# EAGLE design 5draft_onBoard_rework (EAGLE 8.1.0)
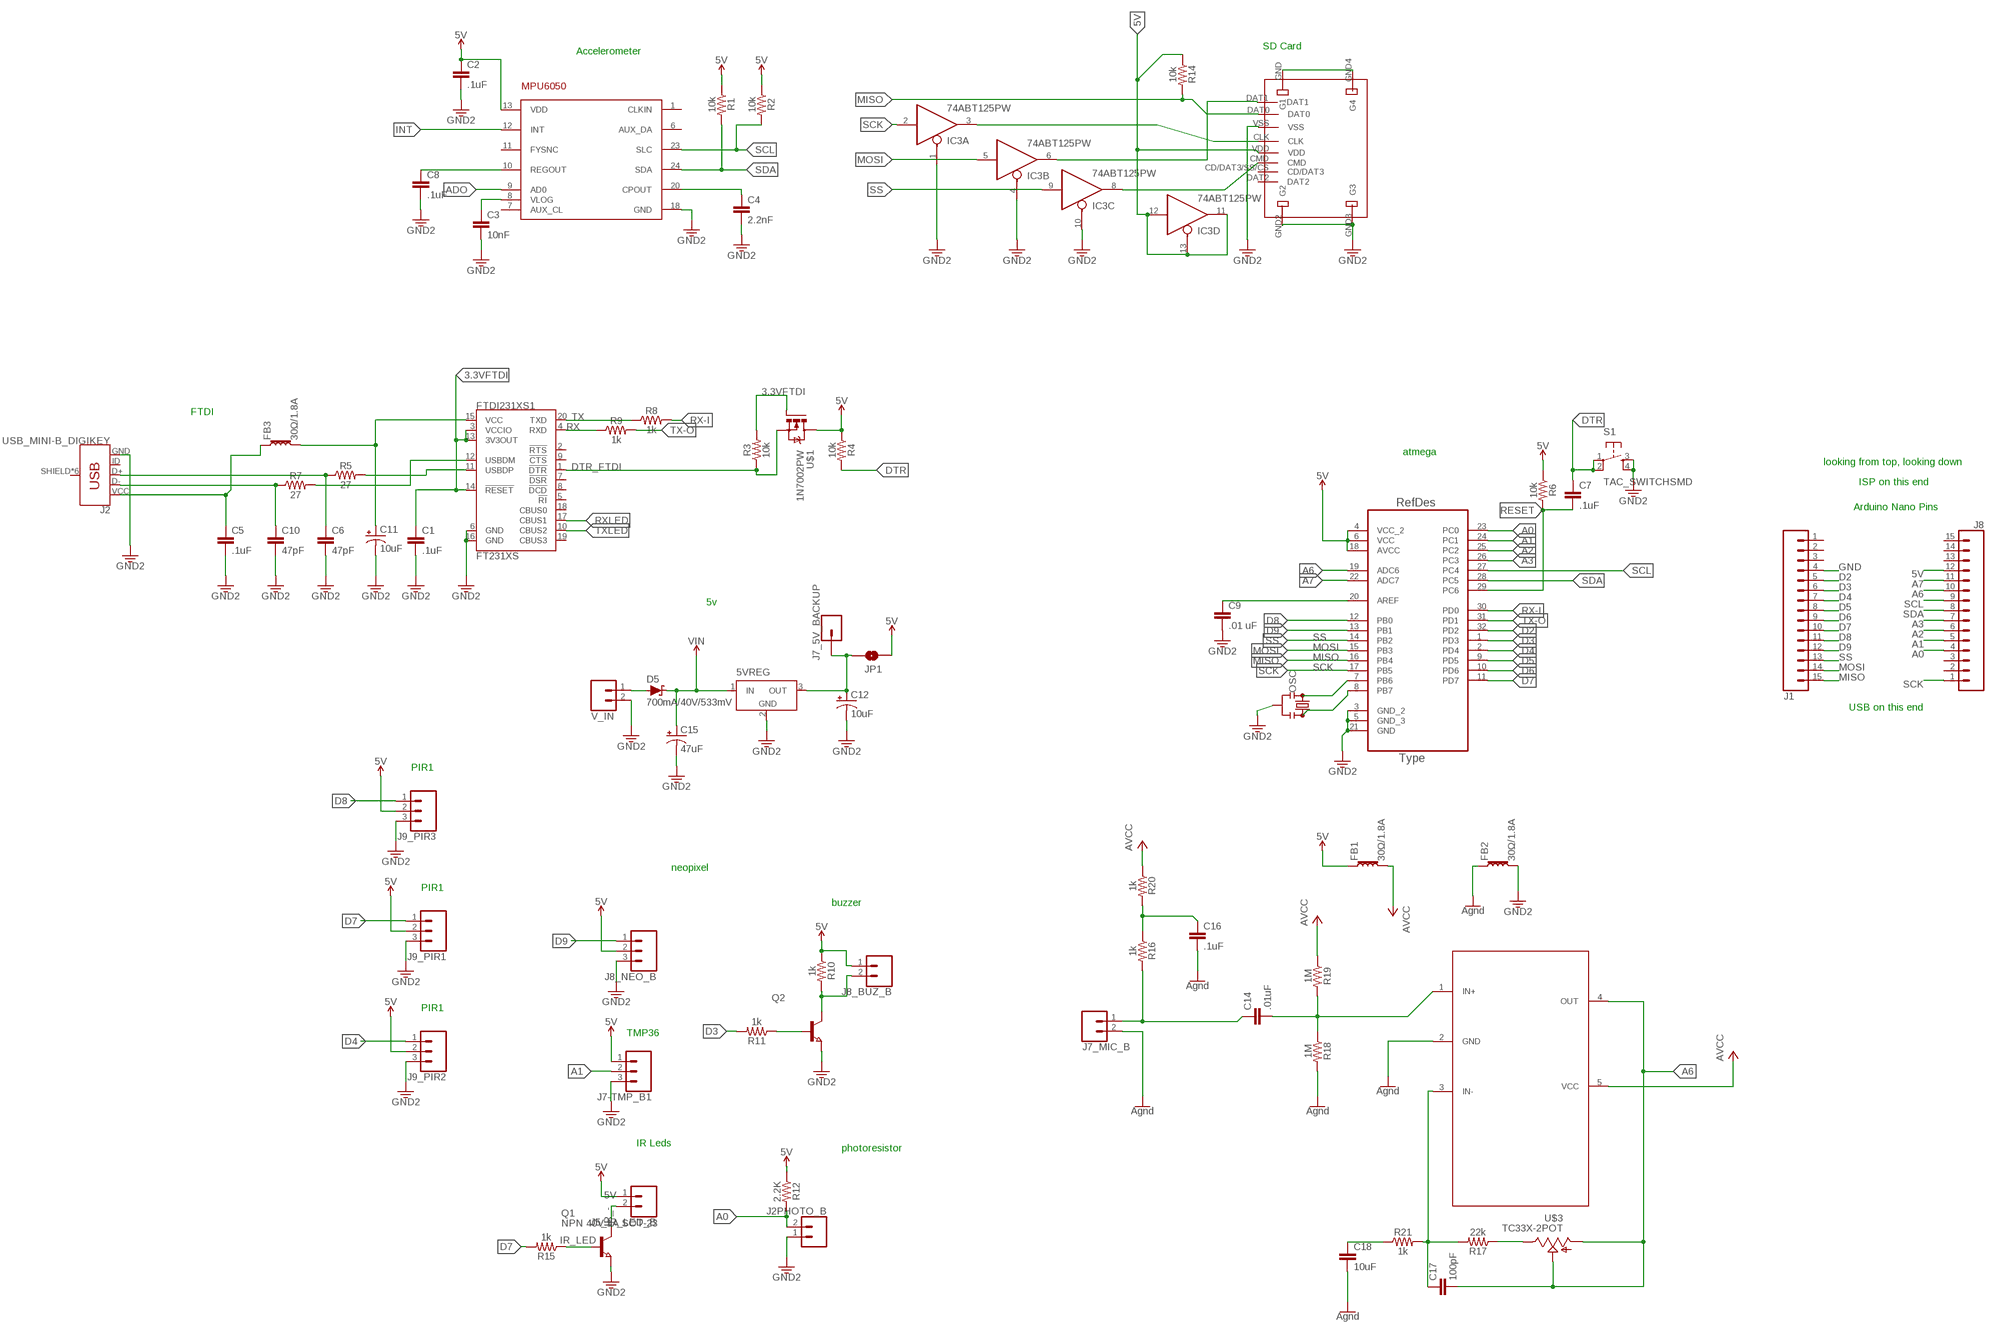
[diagram p0: schematic, sheet 1]

## Parts
5VREG  LT1129CST5  [SOT223]
ATMEGA328P-AU  ATMEGA328P-AU  [QFP80P900X900X120-32N]
C1  .1uF  .22UF-CER  [0402-CAP]
C2  .1uF  .22UF-CER  [0402-CAP]
C3  10nF  .22UF-CER  [0402-CAP]
C4  2.2nF  .22UF-CER  [0402-CAP]
C5  .1uF  .22UF-CER  [0402-CAP]
C6  47pF  .22UF-CER  [0402-CAP]
C7  .1uF  .22UF-CER  [0402-CAP]
C8  .1uF  .22UF-CER  [0402-CAP]
C9  .01 uF  .22UF-CER  [0402-CAP]
C10  47pF  .22UF-CER  [0402-CAP]
C11  10uF  10UF-TANT  [EIA3216]
C12  10uF  10UF-TANT  [EIA3216]
C14  .01uF  .22UF-CER  [0402-CAP]
C15  47uF  10UF-TANT  [EIA3216]
C16  .1uF  .22UF-CER  [0402-CAP]
C17  100pF  .22UF-CER  [0402-CAP]
C18  10uF  .22UF-CER  [0402-CAP]
D5  700mA/40V/533mV  DIODE-SCHOTTKY-ZLLS500  [SOT23-3]
FB1  30Ω/1.8A  FERRITE_BEAD-0603  [0603]
FB2  30Ω/1.8A  FERRITE_BEAD-0603  [0603]
FB3  30Ω/1.8A  FERRITE_BEAD-0603  [0603]
FTDI231XS1  FT231XS  [SSOP20_L]
IC3  74ABT125PW  [TSSOP14]
IC4  MAX4466KS  [SC70-5]
J1  CONN_15  [1X15]
J2  USB_MINI-B_DIGIKEY  [MICRO-USB-DIGIKEY-FCI2]
J2PHOTO_B  CONN_02LOCK  [1X02_LOCK]
J5_IR_LED_B  CONN_02LOCK  [1X02_LOCK]
J7-TMP_B1  CONN_03  [1X03]
J7_5V_BACKUP  CONN_01  [1X01]
J7_MIC_B  CONN_02LOCK  [1X02_LOCK]
J8  CONN_15  [1X15]
J8_BUZ_B  CONN_02LOCK  [1X02_LOCK]
J8_NEO_B  CONN_03  [1X03]
J9_PIR1  CONN_03  [1X03]
J9_PIR2  CONN_03  [1X03]
J9_PIR3  CONN_03  [1X03]
JP1  JUMPER-SMT_2_NO_NO-SILK_ROUND  [SMT-JUMPER_2_NO_NO-SILK_ROUND]
MPU6050  MPU-6050  [QFN24-4X4]
OSC  RESONATORSMD-3.2X1.3  [RESONATOR-SMD-3.2X1.3]
Q1  NPN 40V 1A SOT-23  NPN-TRANSISTOR_SOT23  [SOT23]
Q2  NPN-TRANSISTOR_SOT23  [SOT23]
R1  10k  0.05OHM-0603-1/5W-1%  [0603]
R2  10k  0.05OHM-0603-1/5W-1%  [0603]
R3  10k  0.05OHM-0603-1/5W-1%  [0603]
R4  10k  0.05OHM-0603-1/5W-1%  [0603]
R5  27  0.05OHM-0603-1/5W-1%  [0603]
R6  10k  0.05OHM-0603-1/5W-1%  [0603]
R7  27  0.05OHM-0603-1/5W-1%  [0603]
R8  1k  0.05OHM-0603-1/5W-1%  [0603]
R9  1k  0.05OHM-0603-1/5W-1%  [0603]
R10  1k  0.05OHM-0603-1/5W-1%  [0603]
R11  1k  0.05OHM-0603-1/5W-1%  [0603]
R12  2.2K  0.05OHM-0603-1/5W-1%  [0603]
R14  10k  0.05OHM-0603-1/5W-1%  [0603]
R15  1k  0.05OHM-0603-1/5W-1%  [0603]
R16  1k  0.05OHM-0603-1/5W-1%  [0603]
R17  22k  0.05OHM-0603-1/5W-1%  [0603]
R18  1M  0.05OHM-0603-1/5W-1%  [0603]
R19  1M  0.05OHM-0603-1/5W-1%  [0603]
R20  1k  0.05OHM-0603-1/5W-1%  [0603]
R21  1k  0.05OHM-0603-1/5W-1%  [0603]
S1  TAC_SWITCHSMD  [TACTILE-SWITCH-SMD]
U$1  1N7002PW  [SOT323W_INFINEON]
U$2  WM6698TR-ND_MICROSD  [MICROSD2]
U$3  TC33X-2POT  [TC33X-2]
V_IN  CONN_02LOCK  [1X02_LOCK]

## Nets
2.2NF: C4.1 MPU6050.20(CPOUT)
3.3VFTDI: C1.1 FTDI231XS1.3(VCCIO) FTDI231XS1.13(3V3OUT) FTDI231XS1.14(!RESET) R3.2 U$1.1(G)
5REGOUT: 5VREG.3(OUT) C12.A(+) J7_5V_BACKUP.1 JP1.2
5V: ATMEGA328P-AU.4(VCC_2) ATMEGA328P-AU.6(VCC) ATMEGA328P-AU.18(AVCC) C2.1 FB1.1 IC3.11(D:O) IC3.12(D:I) IC3.13(D:OE) J5_IR_LED_B.1 J7-TMP_B1.1 J8.12 J8_NEO_B.2 J9_PIR1.2 J9_PIR2.2 J9_PIR3.2 JP1.1 MPU6050.13(VDD) R1.1 R2.1 R4.1 R6.1 R12.1 R14.1 U$1.3(D) U$2.VDD
10NF: C3.1 MPU6050.8(VLOG)
.UF: C8.1 MPU6050.10(REGOUT)
A0: ATMEGA328P-AU.23(PC0) J2PHOTO_B.2 J8.4 R12.2
A1: ATMEGA328P-AU.24(PC1) J7-TMP_B1.2 J8.5
A2: ATMEGA328P-AU.25(PC2) J8.6
A3: ATMEGA328P-AU.26(PC3) J8.7
A6: ATMEGA328P-AU.19(ADC6) C17.2 IC4.4(OUT) J8.10 U$3.2 U$3.3
A7: ATMEGA328P-AU.22(ADC7) J8.11
ADO: MPU6050.9(AD0)
AVCC: FB1.2 IC4.5(VCC) R19.1 R20.1
BUZ+: J8_BUZ_B.1 R10.1 ; supply symbol labelled 5V
BUZ-: J8_BUZ_B.2 Q2.3(C) R10.2
D2: ATMEGA328P-AU.32(PD2) J1.5
D3: ATMEGA328P-AU.1(PD3) J1.6 R11.2
D4: ATMEGA328P-AU.2(PD4) J1.7 J9_PIR2.1
D5: ATMEGA328P-AU.9(PD5) J1.8
D6: ATMEGA328P-AU.10(PD6) J1.9
D7: ATMEGA328P-AU.11(PD7) J1.10 J9_PIR1.1 R15.2
D8: ATMEGA328P-AU.12(PB0) J1.11 J9_PIR3.1
D9: ATMEGA328P-AU.13(PB1) J1.12 J8_NEO_B.1
D+_P: C6.1 J2.D+ R5.1
D-_N: C10.1 J2.D- R7.1
DTR: C7.1 R4.2 S1.1 S1.2
DTR_FTDI: FTDI231XS1.1(!DTR) R3.1 U$1.2(S)
GND: 5VREG.2(GND) ATMEGA328P-AU.3(GND_2) ATMEGA328P-AU.5(GND_3) ATMEGA328P-AU.21(GND) C1.2 C2.2 C3.2 C4.2 C5.2 C6.2 C8.2 C9.2 C10.2 C11.C(-) C12.C(-) C15.C(-) C16.2 C18.2 FB2.1 FB2.2 FTDI231XS1.6(GND) FTDI231XS1.16(GND) IC3.1(A:OE) IC3.4(B:OE) IC3.10(C:OE) IC4.2(GND) J1.4 J2.GND J2PHOTO_B.1 J7-TMP_B1.3 J7_MIC_B.2 J8_NEO_B.3 J9_PIR1.3 J9_PIR2.3 J9_PIR3.3 MPU6050.18(GND) OSC.2 Q1.2(E) Q2.2(E) R18.2 S1.3 S1.4 U$2.GND2(G2) U$2.GND3(G3) U$2.GND4(G4) U$2.GND(G1) U$2.VSS V_IN.2 ; supply symbol labelled GND2, Agnd
INT: MPU6050.12(INT)
IR_-: J5_IR_LED_B.2 Q1.3(C)
IR_LED: Q1.1(B) R15.1
MISO: ATMEGA328P-AU.16(PB4) J1.15 R14.2 U$2.DAT0
MOSI: ATMEGA328P-AU.15(PB3) IC3.5(B:I) J1.14
N$6: ATMEGA328P-AU.20(AREF) C9.1
N$10: IC3.6(B:O) U$2.DAT1
N$12: R17.1 U$3.1
N$17: C16.1 R16.1 R20.2
N$20: Q2.1(B) R11.1
N$22: D5.1(A) V_IN.1
N$24: C14.1 J7_MIC_B.1 R16.2
N$25: C14.2 IC4.1(IN+) R18.1 R19.2
N$29: C18.1 R21.1
N$30: C17.1 IC4.3(IN-) R17.2 R21.2
PB6: ATMEGA328P-AU.7(PB6) OSC.1
PB7: ATMEGA328P-AU.8(PB7) OSC.3
RESET: ATMEGA328P-AU.29(PC6) C7.2 R6.2
RX: FTDI231XS1.4(RXD) R9.1
RX-I: ATMEGA328P-AU.30(PD0) R8.2
RXLED: FTDI231XS1.17(CBUS1)
SCK: ATMEGA328P-AU.17(PB5) IC3.2(A:I) J8.1
SCK_BUFF: IC3.3(A:O) U$2.CLK
SCL: ATMEGA328P-AU.27(PC4) J8.9 MPU6050.23(SLC) R2.2
SDA: ATMEGA328P-AU.28(PC5) J8.8 MPU6050.24(SDA) R1.2
SS: ATMEGA328P-AU.14(PB2) IC3.9(C:I) J1.13
SS_BUFF: IC3.8(C:O) U$2.CMD
TX: FTDI231XS1.20(TXD) R8.1
TX-O: ATMEGA328P-AU.31(PD1) R9.2
TXLED: FTDI231XS1.10(CBUS2)
USBDM_N: FTDI231XS1.12(USBDM) R7.2
USBDM_P: FTDI231XS1.11(USBDP) R5.2
VIN: 5VREG.1(IN) C15.A(+) D5.3(C)
VUSB: C5.1 C11.A(+) FB3.1 FB3.2 FTDI231XS1.15(VCC) J2.VCC(VBUS)
Unconnected: FTDI231XS1.2(!RTS) FTDI231XS1.5(!RI) FTDI231XS1.7(!DSR) FTDI231XS1.8(!DCD) FTDI231XS1.9(!CTS) FTDI231XS1.18(CBUS0) FTDI231XS1.19(CBUS3) J1.1 J1.2 J1.3 J2.ID J2.SHIELD J2.SHIELD1(SHIELD) J2.SHIELD2(SHIELD) J2.SHIELD3(SHIELD) J2.SHIELD4(SHIELD) J2.SHIELD5(SHIELD) J8.2 J8.3 J8.13 J8.14 J8.15 MPU6050.1(CLKIN) MPU6050.6(AUX_DA) MPU6050.7(AUX_CL) MPU6050.11(FYSNC) U$2.CD/DAT3/SS/CS(CD/DAT3) U$2.DAT2

## Notes on the sheet
- SD Card
- Accelerometer
- FTDI
- atmega
- looking from top, looking down
- ISP on this end
- Arduino Nano Pins
- 5v
- USB on this end
- PIR1
- neopixel
- PIR1
- buzzer
- PIR1
- TMP36
- IR Leds
- photoresistor

## Power pins joined to a net without a drawn wire
AVCC: IC3.14(P:VCC)
GND: 5VREG.4(GND) IC3.7(P:GND)

## Library data of the parts
5VREG = linear-technology:LT1129CST5: VOLTAGE REGULATOR with shutdown; MPN: LT1129CST-5#PBF; OC_FARNELL: 1663375; OC_NEWARK: 57M2069
ATMEGA328P-AU = Atmega-328pu:ATMEGA328P-AU; DESCRIPTION: 8-bit Microcontroller with In-System Programmable Flash; MPN: ATMEGA328P-AU; OC_FARNELL: 1715486; OC_NEWARK: 14R4631; PACKAGE: TQFP-32; SUPPLIER: Atmel
C1-C10 C14 C16-C18 = SparkFun-Retired:.22UF-CER: .22uF ceramic SMT CAP-09885- 50V +80%/-20% (0603); PROD_ID: CAP-09885; VALUE: .22uF
C11 C12 = SparkFun-Retired:10UF-TANT: 10uF Tantalum SMT CAP-00811- 16V 10% (EIA-3216); PROD_ID: CAP-00811
C15 = SparkFun-Retired:10UF-TANT: 10uF Tantalum SMT CAP-00811- 16V 10% (EIA-3216); PROD_ID: CAP-00811; VALUE: 10uF
D5 = SparkFun-DiscreteSemi:DIODE-SCHOTTKY: Schottky diode A Schottky diode is a semiconductor diode which has a low forward voltage drop and a very fast switching action.; PROD_ID: DIO-08411
FB1-FB3 = SparkFun-Coils:FERRITE_BEAD: Ferrite Bead (blocks, cores, rings, chokes, etc.) Inductor with layers of ferrite used to suppress high frequencies. Often used to isolate high frequency noise. SparkFun Products: IOIO-OTG - V2.2 <https://www.sparkfun.com/products/13613> SparkFun SAMD21 Mini Breakout <https://www.sparkfun.com/products/13664> SparkFun 6 Degrees of Freedom Breakout - LSM6DS3 <https://www.sparkfun.com/products/13339> SparkFun SAMD21 Dev Breakout <https://www.sparkfun.com/products/13672>; PROD_ID: NDUC-07859
FTDI231XS1 = SparkFun-IC-Comms:FT231X: FTDI FT231X Full Speed USB to Full-handshake UART This USB2.0 Full Speed IC offers a compact bridge to full handshake UART interfaces. The device is a UART, capable of operating up to 3MBaud, with low power consumption (8mA). The FT231X includes the complete FT-X series feature set and enables USB to be added into a system design quickly and easily over a UART interface. Datasheet <http://cdn.sparkfun.com/datasheets/Components/General%20IC/DS_FT231X.pdf> SparkFun Products SparkFun RedBoard - Programmed with Arduino <https://www.sparkfun.com/products/12757> (DEV-12757) SparkFun XBee Explorer USB <https://www.sparkfun.com/products/11812> (WRL-11812) SparkFun XBee Explorer Dongle <https://www.sparkfun.com/products/11697> (WRL-11697) SparkFun Blynk Board - ESP8266 <https://www.sparkfun.com/products/13794> (WRL-13794) SparkFun ESP8266 Thing - Dev Board <https://www.sparkfun.com/products/13711> (WRL-13711) SparkFun Block for Intel® Edison - Base <https://www.sparkfun.com/products/13045> (DEV-13045) SparkFun RedStick <https://www.sparkfun.com/products/13741> (DEV-13741) SparkFun Beefy 3 - FTDI Basic Breakout <https://www.sparkfun.com/products/13746> (DEV-13746) SparkFun FT231X Breakout <https://www.sparkfun.com/products/11736> (BOB-11736); PROD_ID: IC-11524
IC3 = 74xx-us:74*125: Quad bus BUFFER, 3-state
IC4 = KevinKuwata1:MAX4466: MAX4466 SOT23 SC70 mic amp arduino adafruit sparkfun
J1 J8 = SparkFun-Connectors:CONN_15: Multi connection point. Often used as Generic Header-pin footprint for 0.1 inch spaced/style header connections On any of the 0.1 inch spaced packages, you can populate with these: Break Away Headers - Straight <https://www.sparkfun.com/products/116> (PRT-00116) Break Away Male Headers - Right Angle <https://www.sparkfun.com/products/553> (PRT-00553) Female Headers <https://www.sparkfun.com/products/115> (PRT-00115) Break Away Headers - Machine Pin <https://www.sparkfun.com/products/117> (PRT-00117) Break Away Female Headers - Swiss Machine Pin <https://www.sparkfun.com/products/743> (PRT-00743) For SCREWTERMINALS and SPRING TERMINALS visit here: Screw Terimnals on SparkFun.com <https://www.sparkfun.com/search/results?term=Screw+Terminals> (5mm/3.5mm/2.54mm spacing) This device is also useful as a general connection point to wire up your design to another part of your project. Our various solder wires solder well into these plated through hole pads. Hook-Up Wire - Assortment (Stranded, 22 AWG) <https://www.sparkfun.com/products/11375> (PRT-11375) Hook-Up Wire - Assortment (Solid Core, 22 AWG) <https://www.sparkfun.com/products/11367> (PRT-11367) View the entire wire category on our website here <https://www.sparkfun.com/categories/141> Special notes: Molex polarized connector foot print use with SKU : PRT-08231 with associated crimp pins and housings. 1MM SMD Version SKU: PRT-10208 NOTES ON THE VARIANTS LOCK and LOCK_LONGPADS... This footprint was designed to help hold the alignment of a through-hole component (i.e. 6-pin header) while soldering it into place. You may notice that each hole has been shifted either up or down by 0.005 of an inch from it's more standard position (which is a perfectly straight line). This slight alteration caused the pins (the squares in the middle) to touch the edges of the holes. Because they are alternating, it causes a "brace" to hold the component in place. 0.005 has proven to be the perfect amount of "off-center" position when using our standard breakaway headers. Although looks a little odd when you look at the bare footprint, once you have a header in there, the alteration is very hard to notice. Also,if you push a header all the way into place, it is covered up entirely on the bottom side.
J2 = KevinKuwata1:USB_MINI-B_DIGIKEY: USB type Mini-B Connector Breaks out 5th pin, and includes shield pins if needed. SparkFun Products: SparkFun FTDI Basic Breakout <https://www.sparkfun.com/products/9716> SparkFun XBee Explorer USB <https://www.sparkfun.com/products/11812> SparkFun Redboard <https://www.sparkfun.com/products/12757>
J2PHOTO_B J5_IR_LED_B J7_MIC_B J8_BUZ_B V_IN = SparkFun-Connectors:CONN_02: Multi connection point. Often used as Generic Header-pin footprint for 0.1 inch spaced/style header connections On any of the 0.1 inch spaced packages, you can populate with these: Break Away Headers - Straight <https://www.sparkfun.com/products/116> (PRT-00116) Break Away Male Headers - Right Angle <https://www.sparkfun.com/products/553> (PRT-00553) Female Headers <https://www.sparkfun.com/products/115> (PRT-00115) Break Away Headers - Machine Pin <https://www.sparkfun.com/products/117> (PRT-00117) Break Away Female Headers - Swiss Machine Pin <https://www.sparkfun.com/products/743> (PRT-00743) For SCREWTERMINALS and SPRING TERMINALS visit here: Screw Terimnals on SparkFun.com <https://www.sparkfun.com/search/results?term=Screw+Terminals> (5mm/3.5mm/2.54mm spacing) This device is also useful as a general connection point to wire up your design to another part of your project. Our various solder wires solder well into these plated through hole pads. Hook-Up Wire - Assortment (Stranded, 22 AWG) <https://www.sparkfun.com/products/11375> (PRT-11375) Hook-Up Wire - Assortment (Solid Core, 22 AWG) <https://www.sparkfun.com/products/11367> (PRT-11367) View the entire wire category on our website here <https://www.sparkfun.com/categories/141> Special notes: Molex polarized connector foot print use with: PRT-08233 with associated crimp pins and housings. 2.54_SCREWTERM for use with PRT-10571. 3.5mm Screw Terminal footprints for PRT-08084 5mm Screw Terminal footprints for use with PRT-08432
J7-TMP_B1 J8_NEO_B J9_PIR1-J9_PIR3 = SparkFun-Connectors:CONN_03: Multi connection point. Often used as Generic Header-pin footprint for 0.1 inch spaced/style header connections On any of the 0.1 inch spaced packages, you can populate with these: Break Away Headers - Straight <https://www.sparkfun.com/products/116> (PRT-00116) Break Away Male Headers - Right Angle <https://www.sparkfun.com/products/553> (PRT-00553) Female Headers <https://www.sparkfun.com/products/115> (PRT-00115) Break Away Headers - Machine Pin <https://www.sparkfun.com/products/117> (PRT-00117) Break Away Female Headers - Swiss Machine Pin <https://www.sparkfun.com/products/743> (PRT-00743) Stackable Header - 3 Pin (Female, 0.1") <https://www.sparkfun.com/products/13875> (PRT-13875) For SCREWTERMINALS and SPRING TERMINALS visit here: Screw Terimnals on SparkFun.com <https://www.sparkfun.com/search/results?term=Screw+Terminals> (5mm/3.5mm/2.54mm spacing) This device is also useful as a general connection point to wire up your design to another part of your project. Our various solder wires solder well into these plated through hole pads. Hook-Up Wire - Assortment (Stranded, 22 AWG) <https://www.sparkfun.com/products/11375> (PRT-11375) Hook-Up Wire - Assortment (Solid Core, 22 AWG) <https://www.sparkfun.com/products/11367> (PRT-11367) View the entire wire category on our website here <https://www.sparkfun.com/categories/141> Special notes: Molex polarized connector foot print use with SKU : PRT-08232 with associated crimp pins and housings.
J7_5V_BACKUP = SparkFun-Connectors:CONN_01: Single connection point. Often used as Generic Header-pin footprint for 0.1 inch spaced/style header connections On any of the 0.1 inch spaced packages, you can populate with these: Break Away Headers - Straight <https://www.sparkfun.com/products/116> (PRT-00116) Break Away Male Headers - Right Angle <https://www.sparkfun.com/products/553> (PRT-00553) Female Headers <https://www.sparkfun.com/products/115> (PRT-00115) Break Away Headers - Machine Pin <https://www.sparkfun.com/products/117> (PRT-00117) Break Away Female Headers - Swiss Machine Pin <https://www.sparkfun.com/products/743> (PRT-00743) This device is also useful as a general connection point to wire up your design to another part of your project. Our various solder wires solder well into these plated through hole pads. Hook-Up Wire - Assortment (Stranded, 22 AWG) <https://www.sparkfun.com/products/11375> (PRT-11375) Hook-Up Wire - Assortment (Solid Core, 22 AWG) <https://www.sparkfun.com/products/11367> (PRT-11367) View the entire wire category on our website here <https://www.sparkfun.com/categories/141> Special notes: SMTSO-256-ET is a "flush mount" nut for a 4-40 screw. We mostly use this on specialty testbeds; it is a nice way to connect hardware to your PCB at an adjustable hieght. Also note, the SNAP packages are for using a snappable style connector. We sell a baggie of snaps and they are also used on two LilyPad designs: Snap Assortment - 30 pack (male and female) <https://www.sparkfun.com/products/11347> (DEV-11347) LilyPad Arduino SimpleSnap <https://www.sparkfun.com/products/10941> (DEV-10941) LilyPad SimpleSnap Protoboard <https://www.sparkfun.com/products/10940> (DEV-10940)
JP1 = SparkFun-Jumpers:JUMPER-SMT_2_NO: Normally open jumper This jumper has two pads in close proximity to each other. Apply solder to close the connection. Round pads are easier to solder for beginners, but are a lot larger. SparkFun Product that uses the round pads: SparkFun EL Sequencer <https://www.sparkfun.com/products/12781>
MPU6050 = KevinKuwata1:MPU-6050
OSC = SparkFun-Clocks:RESONATOR: Resonators (Generic) Ceramic resonators are clock-generating components, often used to control timing in microcontrollers. They usually have 3 pins: two pins for oscillation, and one pin for ground. Compared to crystals, resonators have worse tolerance, but are usually much cheaper. Plus, they have built-in load capacitors! These devices are used on boards like the Arduino Pro 8MHz <https://www.sparkfun.com/products/11114> and Arduino Pro 16MHz <https://www.sparkfun.com/products/11113>.
Q1 Q2 = semicon-smd-ipc:NPN-TRANSISTOR_: NPN TRANSISTOR
R1-R12 R14-R21 = SparkFun-Resistors:0.05OHM: 0.05Ω resistor A resistor is a passive two-terminal electrical component that implements electrical resistance as a circuit element. Resistors act to reduce current flow, and, at the same time, act to lower voltage levels within circuits. - Wikipedia; PROD_ID: RES-12535; VALUE: 0.05
S1 = SparkFun-Retired:TAC_SWITCH: Momentary Switch Button commonly used for reset or general input. Spark Fun Electronics SKU : COM-00097 SMT- SWCH-08247; PROD_ID: SWCH-08247
U$1 = KevinKuwata1:1N7002PW
U$2 = KevinKuwata1:WM6698TR-ND_MICROSD
U$3 = KevinKuwata1:TC33X-2POT

## Board
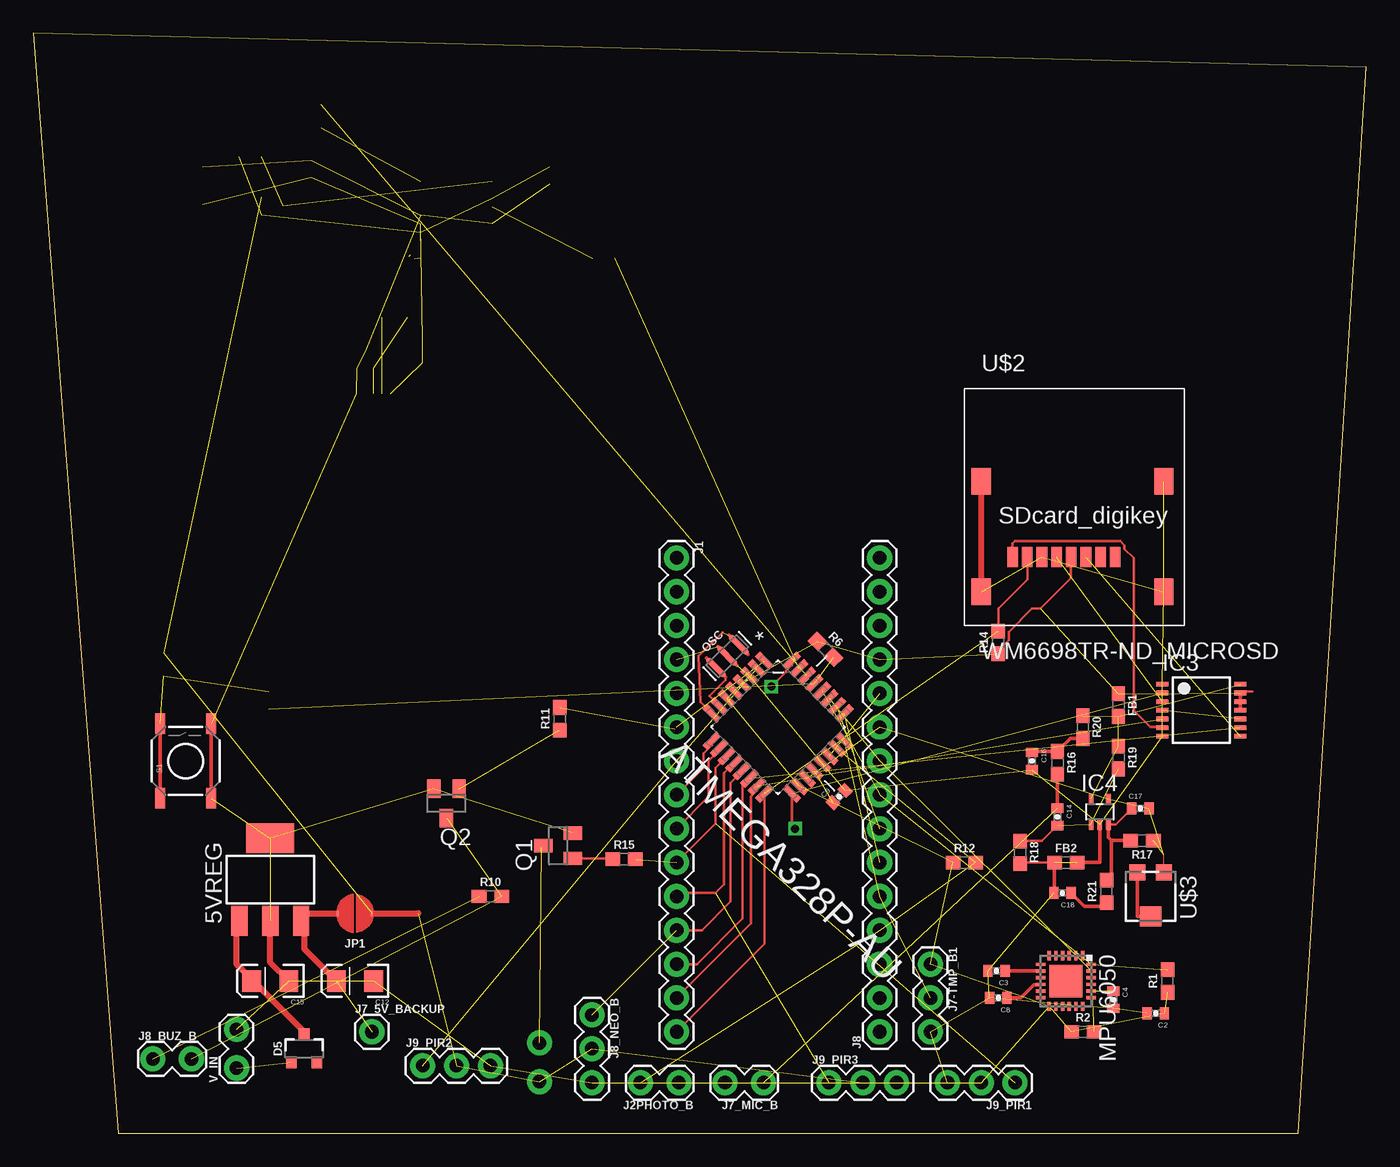
[diagram p1: board, top side]
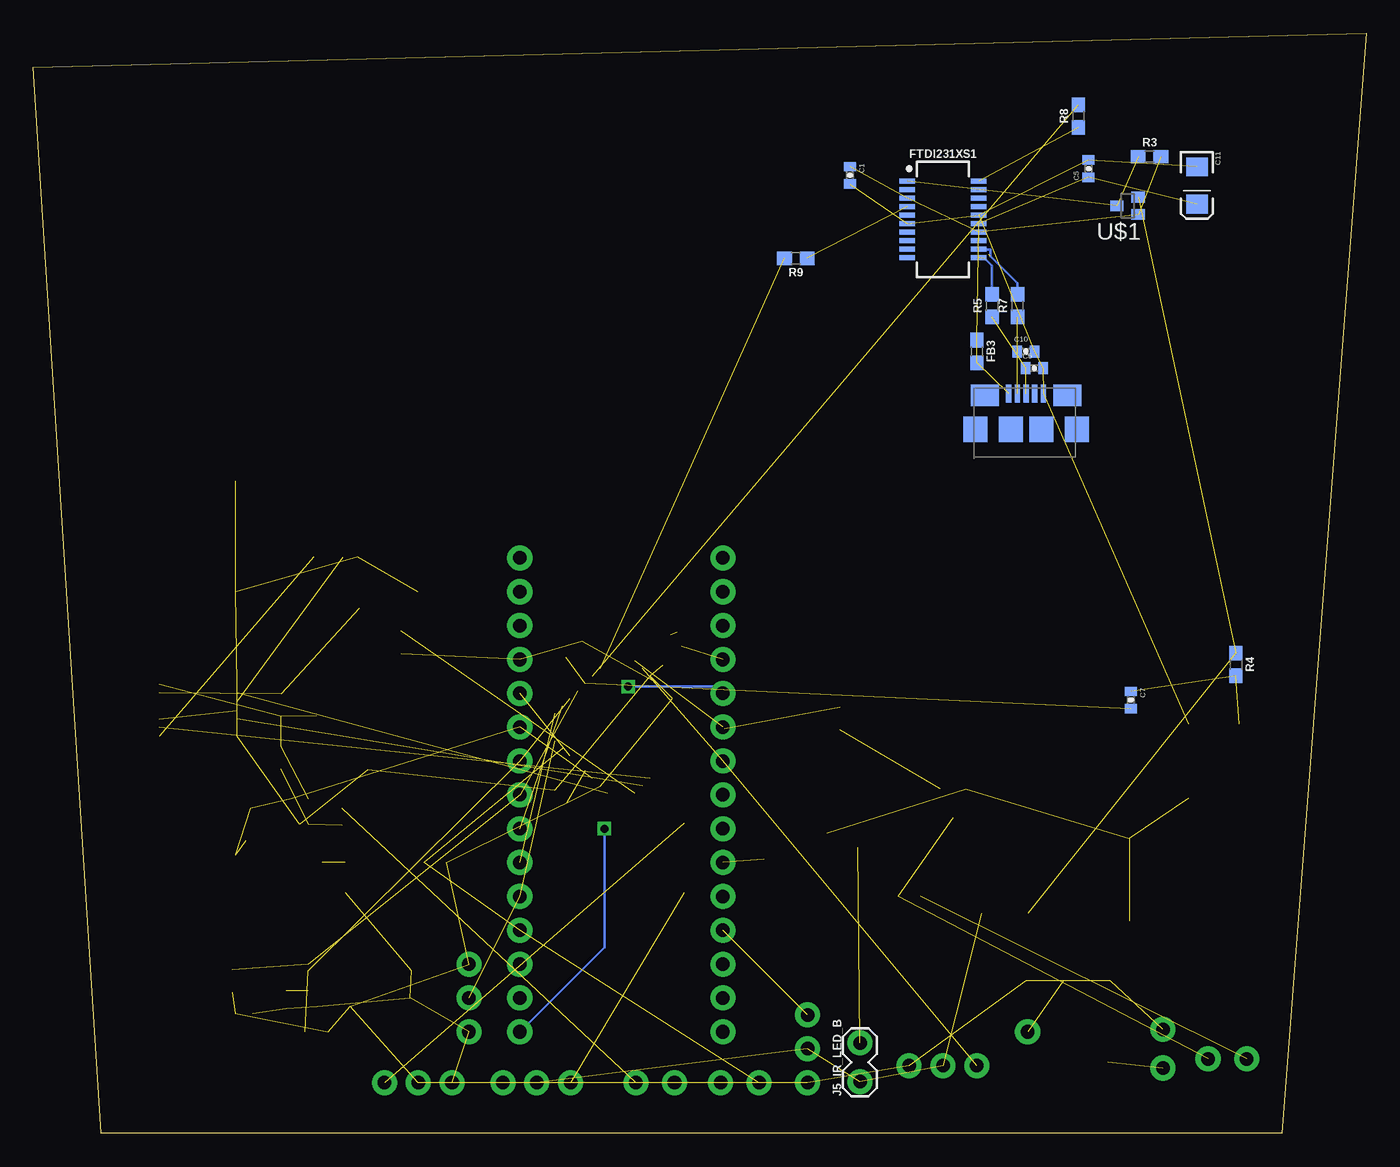
[diagram p2: board, bottom side, seen from below]

Size 100 x 82.54 mm. Coordinates in mm from the lower left corner, seen from the top.
Outline: 6.35,0 94.92,0 100,80 0,82.54 6.35,0
Copper layers (1*16): Top 0.035mm / dielectric 1.5mm / Bottom 0.035mm
Design rules "default *": minimum track width 8mil, minimum drill 14mil, track to track 8mil, track to pad 8mil, pad to pad 8mil, via to via 8mil, smd to smd 8mil, copper to edge 40mil, drill to drill 8mil, minimum pad ring 10mil, minimum via ring 8mil, stop-mask expansion 4mil, vias tented up to drill 0mil, thermal gap 10mil

### Footprints (pad centres in the part's own frame; a part is rotated, then mirrored left to right if it is on the bottom)
SOT223 = smd 1.219 x 2.235: 1 -2.311,-3.099; 2 0,-3.099; 3 2.311,-3.099 | smd 3.6 x 2.2: 4 0,3.099
QFP80P900X900X120-32N = smd 1.473 x 0.508: 1 -4.242,2.794; 2 -4.242,2.007; 3 -4.242,1.194; 4 -4.242,0.406; 5 -4.242,-0.406; 6 -4.242,-1.194; 7 -4.242,-2.007; 8 -4.242,-2.794; 17 4.242,-2.794; 18 4.242,-2.007; 19 4.242,-1.194; 20 4.242,-0.406; 21 4.242,0.406; 22 4.242,1.194; 23 4.242,2.007; 24 4.242,2.794 | smd 0.508 x 1.473: 9 -2.794,-4.242; 10 -2.007,-4.242; 11 -1.194,-4.242; 12 -0.406,-4.242; 13 0.406,-4.242; 14 1.194,-4.242; 15 2.007,-4.242; 16 2.794,-4.242; 25 2.794,4.242; 26 2.007,4.242; 27 1.194,4.242; 28 0.406,4.242; 29 -0.406,4.242; 30 -1.194,4.242; 31 -2.007,4.242; 32 -2.794,4.242
0402-CAP = smd 0.7 x 0.9: 1 -0.65,0; 2 0.65,0
EIA3216 = smd 1.4 x 1.6: A 1.4,0; C -1.4,0
SOT23-3 = smd 0.8 x 0.9: 1 -0.95,-1; 2 0.95,-1; 3 0,1.1
0603 = smd 1.1 x 1: 1 -0.85,0; 2 0.85,0
SSOP20_L = smd 0.381 x 1.143: 1 -2.857,-2.68; 2 -2.223,-2.68; 3 -1.587,-2.68; 4 -0.953,-2.68; 5 -0.318,-2.68; 6 0.318,-2.68; 7 0.953,-2.68; 8 1.587,-2.68; 9 2.223,-2.68; 10 2.857,-2.68; 11 2.857,2.68; 12 2.223,2.68; 13 1.587,2.68; 14 0.953,2.68; 15 0.318,2.68; 16 -0.318,2.68; 17 -0.953,2.68; 18 -1.587,2.68; 19 -2.223,2.68; 20 -2.857,2.68
TSSOP14 = smd 0.35 x 0.9: 1 -1.95,-2.925; 2 -1.3,-2.925; 3 -0.65,-2.925; 4 0,-2.925; 5 0.65,-2.925; 6 1.3,-2.925; 7 1.95,-2.925; 8 1.95,2.925; 9 1.3,2.925; 10 0.65,2.925; 11 0,2.925; 12 -0.65,2.925; 13 -1.3,2.925; 14 -1.95,2.925
SC70-5 = smd 0.35 x 0.8: 1 -0.65,-0.95; 2 0,-0.95; 3 0.65,-0.95; 4 0.65,0.95; 5 -0.65,0.95
1X15 = drill 1.016 pad 1.88: 1 0,0; 2 2.54,0; 3 5.08,0; 4 7.62,0; 5 10.16,0; 6 12.7,0; 7 15.24,0; 8 17.78,0; 9 20.32,0; 10 22.86,0; 11 25.4,0; 12 27.94,0; 13 30.48,0; 14 33.02,0; 15 35.56,0
MICRO-USB-DIGIKEY-FCI2 = smd 0.4 x 1.35: D+ 0,2.67; D- -0.65,2.67; GND 1.3,2.67; ID 0.65,2.67; VCC -1.3,2.67 | smd 2.1 x 1.6: SHIELD -3.1,2.55; SHIELD1 3.1,2.55 | smd 1.8 x 1.9: SHIELD2 -3.8,0; SHIELD3 -1.15,0; SHIELD4 1.15,0; SHIELD5 3.8,0
1X02_LOCK = drill 1.016 pad 1.88: 1 -0.178,0; 2 2.718,0
1X03 = drill 1.016 pad 1.88: 1 0,0; 2 2.54,0; 3 5.08,0
1X01 = drill 1.016 pad 1.88: 1 0,0
SMT-JUMPER_2_NO_NO-SILK_ROUND = smd 0.152 x 0.305: 1 -1.27,0; 2 1.27,0
QFN24-4X4 = smd 0.7 x 0.25: 1 -1.9,1.25; 2 -1.9,0.75; 3 -1.9,0.25; 4 -1.9,-0.25; 5 -1.9,-0.75; 6 -1.9,-1.25; 13 1.9,-1.25; 14 1.9,-0.75; 15 1.9,-0.25; 16 1.9,0.25; 17 1.9,0.75; 18 1.9,1.25 | smd 0.25 x 0.7: 7 -1.25,-1.9; 8 -0.75,-1.9; 9 -0.25,-1.9; 10 0.25,-1.9; 11 0.75,-1.9; 12 1.25,-1.9; 19 1.25,1.9; 20 0.75,1.9; 21 0.25,1.9; 22 -0.25,1.9; 23 -0.75,1.9; 24 -1.25,1.9 | smd 2.45 x 2.45: EXP 0,0
RESONATOR-SMD-3.2X1.3 = smd 0.45 x 1.905: 1 -1.2,0; 2 0,0; 3 1.2,0
SOT23 = smd 1 x 1.4: 1 -0.95,-1.1; 2 0.95,-1.1; 3 0,1.1
TACTILE-SWITCH-SMD = smd 1.524 x 0.762: 1 -2.794,1.905; 2 2.794,1.905; 3 -2.794,-1.905; 4 2.794,-1.905
SOT323W_INFINEON = smd 1 x 0.8: 1 -0.8,0.65; 2 0.8,0; 3 -0.8,-0.65
MICROSD2 = smd 0.8 x 1.5: CD/DAT3/SS/CS 8.95,2.6; CLK 5.65,2.6; CMD 7.85,2.6; DAT0 3.45,2.6; DAT1 2.35,2.6; DAT2 10.05,2.6; VDD 6.75,2.6; VSS 4.55,2.6 | smd 1.45 x 2: GND 0,8.3; GND2 13.7,8.3; GND3 13.7,0; GND4 0,0
TC33X-2 = smd 1.2 x 1.2: 1 -1.8,1; 3 -1.8,-1 | smd 1.5 x 1.6: 2 1.5,0

### Placement (x,y rotation side)
5VREG  17.78,19.05 0 top
ATMEGA328P-AU  55.88,30.48 315 top
C1  38.73,71.88 270 bottom
C2  84.2,9.02 180 top
C3  72.26,12.19 180 top
C4  81.03,10.03 270 top
C5  20.83,72.39 90 bottom
C6  24.89,57.4 0 bottom
C7  17.65,32.51 270 bottom
C8  72.39,10.16 180 top
C9  60.45,25.27 45 top
C10  25.53,58.67 0 bottom
C11  12.7,71.12 270 bottom
C12  24.13,11.43 180 top
C14  76.83,23.75 270 top
C15  17.78,11.43 180 top
C16  74.93,27.94 270 top
C17  83.06,24.38 0 top
C18  77.22,18.03 180 top
D5  20.32,6.35 0 top
FB1  81.41,32.13 270 top
FB2  77.47,20.32 0 top
FB3  29.21,58.67 270 bottom
FTDI231XS1  31.75,68.58 270 bottom
IC3  87.63,31.75 270 top
IC4  80.01,24.13 0 top
J1  48.26,43.18 270 top
J2  25.52,52.83 0 bottom
J2PHOTO_B  48.26,3.81 180 top
J5_IR_LED_B  37.97,4.06 90 bottom
J7-TMP_B1  67.31,12.7 270 top
J7_5V_BACKUP  25.4,7.62 0 top
J7_MIC_B  54.61,3.81 180 top
J8  63.5,7.62 90 top
J8_BUZ_B  9.14,5.59 0 top
J8_NEO_B  41.91,8.89 270 top
J9_PIR1  73.66,3.81 180 top
J9_PIR2  29.21,5.08 0 top
J9_PIR3  59.69,3.81 0 top
JP1  24.13,16.51 180 top
MPU6050  77.47,11.43 270 top
OSC  52.07,35.81 45 top
Q1  39.37,21.59 90 top
Q2  30.99,24.76 180 top
R1  85.09,11.43 90 top
R2  78.74,7.62 0 top
R3  16.26,73.28 0 bottom
R4  9.78,35.18 270 bottom
R5  28.07,62.1 90 bottom
R6  59.44,36.32 315 top
R7  26.16,62.1 90 bottom
R8  21.59,76.33 90 bottom
R9  42.8,65.66 180 bottom
R10  34.29,17.78 0 top
R11  39.5,31.11 90 top
R12  69.85,20.32 0 top
R14  72.39,36.83 90 top
R15  44.32,20.57 0 top
R16  76.83,27.81 270 top
R17  83.18,21.97 180 top
R18  74.04,21.08 270 top
R19  81.41,28.19 270 top
R20  78.74,30.48 270 top
R21  80.52,18.16 90 top
S1  11.43,27.94 90 top
U$1  17.91,69.6 180 bottom
U$2  71.12,40.64 0 top
U$3  83.82,17.78 270 top
V_IN  15.24,5.08 90 top

### Tracks (layer width: path | path; a pad name or v marks a point on that pad's centre or on a via)
2.2NF  (1 unrouted)
  Top 0.254: MPU6050.20
3.3VFTDI  (5 unrouted)
5REGOUT  (1 unrouted)
  Top 0.457: JP1.2 20.65,16.51 5VREG.3 20.32,15.72 20.32,13.84 C12.A
5V  (21 unrouted)
  Top 0.203: 91.44,33.15 90.65,33.15 IC3.13 | R14.1 72.39,36.2 73.19,37 73.19,37.64 74.93,39.37 75.56,39.37 77.85,41.66 77.85,43.22 U$2.VDD
  Top 0.254: IC3.11 IC3.12 IC3.13
  Top 0.457: JP1.1 28.88,16.51
10NF
  Top 0.254: MPU6050.8 72.92,12.18 C3.1
.UF
  Top 0.254: MPU6050.10 75.52,11.13 75.08,11.13 74.11,10.16 C8.1
A0  (3 unrouted)
A1  (2 unrouted)
A2  (1 unrouted)
A3  (1 unrouted)
A6  (4 unrouted)
  Top 0.254: U$3.3 82.82,16.28 U$3.2
A7  (1 unrouted)
AVCC  (4 unrouted)
BUZ+  (1 unrouted)
BUZ-  (2 unrouted)
D2  (via drill 0.6)
  Top 0.203: ATMEGA328P-AU.32 56.9,35.13 56.45,34.68 56.45,34.61 v55.37,33.53
  Bottom 0.203: v55.37,33.53 48.77,33.53 J1.5
D3  (2 unrouted)
  Top 0.203: 48.13,30.35 J1.6
D4  (2 unrouted)
D5
  Top 0.203: ATMEGA328P-AU.9 50.91,29.13 50.27,28.49 50.27,27.41 J1.8
D6
  Top 0.203: ATMEGA328P-AU.10 51.46,28.73 50.67,27.94 50.67,25.27 J1.9
D7  (2 unrouted)
  Top 0.203: ATMEGA328P-AU.11 52.04,28.29 51.18,27.43 51.18,23.24 J1.10
D8  (1 unrouted)
  Top 0.203: ATMEGA328P-AU.12 52.53,27.77 51.82,27.05 51.82,18.67 51.18,18.03 48.51,18.03 J1.11
D9  (1 unrouted)
  Top 0.203: J1.12 50.16,15.24 52.32,17.4 52.32,26.29 53.17,27.13 ATMEGA328P-AU.13
D+_P  (2 unrouted)
D-_N  (2 unrouted)
DTR  (2 unrouted)
  Top 0.254: S1.2 S1.1
DTR_FTDI  (2 unrouted)
GND  (43 unrouted)
  Top 0.203: FB2.1 74.13,20.32 R18.2 | 74.91,27.3 C16.2
  Top 0.254: S1.4 S1.3 | IC4.2 80.01,20.32 FB2.2 | FB2.1 76.62,18.09 C18.2
  Top 0.457: C15.C 17.78,12.83 5VREG.2 | U$2.GND4 U$2.GND
IR_-  (1 unrouted)
  Top 0.203: 38.14,21.46 Q1.3
IR_LED
  Top 0.203: Q1.1 43.41,20.64 R15.1
MISO  (1 unrouted)
  Top 0.203: U$2.DAT0 74.57,41.55 72.39,39.37 R14.2 | ATMEGA328P-AU.16 54.86,14.22 J1.15
MOSI  (1 unrouted)
  Top 0.203: ATMEGA328P-AU.15 54.3,25.74 53.85,25.29 53.85,15.75 J1.14
N$6  (1 unrouted)
N$10
  Top 0.203: U$2.DAT1 73.47,44.26 73.66,44.45 81.54,44.45 81.88,44.12 81.88,43.86 82.55,43.18 82.55,31.75 83.82,30.48 84.67,30.48 IC3.6
N$12  (1 unrouted)
N$17
  Top 0.254: C16.1 75,28.66 R16.1 77.8,29.63 R20.2
N$20  (1 unrouted)
N$22  (1 unrouted)
N$24  (1 unrouted)
  Top 0.203: R16.2 76.83,26.92
  Top 0.254: C14.1 R16.2
N$25  (2 unrouted)
  Top 0.203: R18.1 75.67,21.93 C14.2
  Top 0.254: 76.65,23.28 C14.2
N$29
  Top 0.254: C18.1 77.87,18.02 78.87,17.02 80.22,17.02 R21.1
N$30
  Top 0.203: IC4.3 81.2,23.18 C17.1
  Top 0.254: IC4.3 80.66,22.21 80.9,21.97 | R17.2 80.9,21.97 | 80.9,21.97 80.9,19.39 R21.2
PB6
  Top 0.203: ATMEGA328P-AU.7 50.71,32.81 51.94,34.04 51.94,34.29 51.27,34.97 OSC.1
PB7  (1 unrouted)
  Top 0.203: ATMEGA328P-AU.8 50.04,32.37 49.91,35.81 51.69,37.59 | 52.75,36.66 OSC.3
RESET  (2 unrouted)
RX  (1 unrouted)
RX-I  (1 unrouted)
SCK  (via drill 0.6)  (1 unrouted)
  Top 0.203: ATMEGA328P-AU.17 56.9,23.11 v57.15,22.86
  Bottom 0.203: J8.1 57.15,13.97 v57.15,22.86
SCK_BUFF  (1 unrouted)
SCL  (3 unrouted)
SDA  (3 unrouted)
SS  (1 unrouted)
  Top 0.203: J1.13 49.78,12.7 53.21,16.13 53.21,26.12 ATMEGA328P-AU.14
SS_BUFF  (1 unrouted)
TX  (1 unrouted)
TX-O  (1 unrouted)
USBDM_N  (1 unrouted)
  Bottom 0.203: R7.2 26.16,63.79 28.18,65.8 28.18,66.28 28.19,66.29 29.01,66.29 FTDI231XS1.12
USBDM_P  (1 unrouted)
  Bottom 0.203: R5.2 28.07,65.12 28.59,65.64
VIN
  Top 0.457: D5.3 20.32,7.62 16.38,11.56 | 5VREG.1 15.24,15.72 15.24,12.7 16.38,11.56 | C15.A 16.38,11.56
VUSB  (5 unrouted)